# EasyEDA Pro project ProPrj_VFD_DynoClock_ESP32_2025-04-16.epro, board main board_1
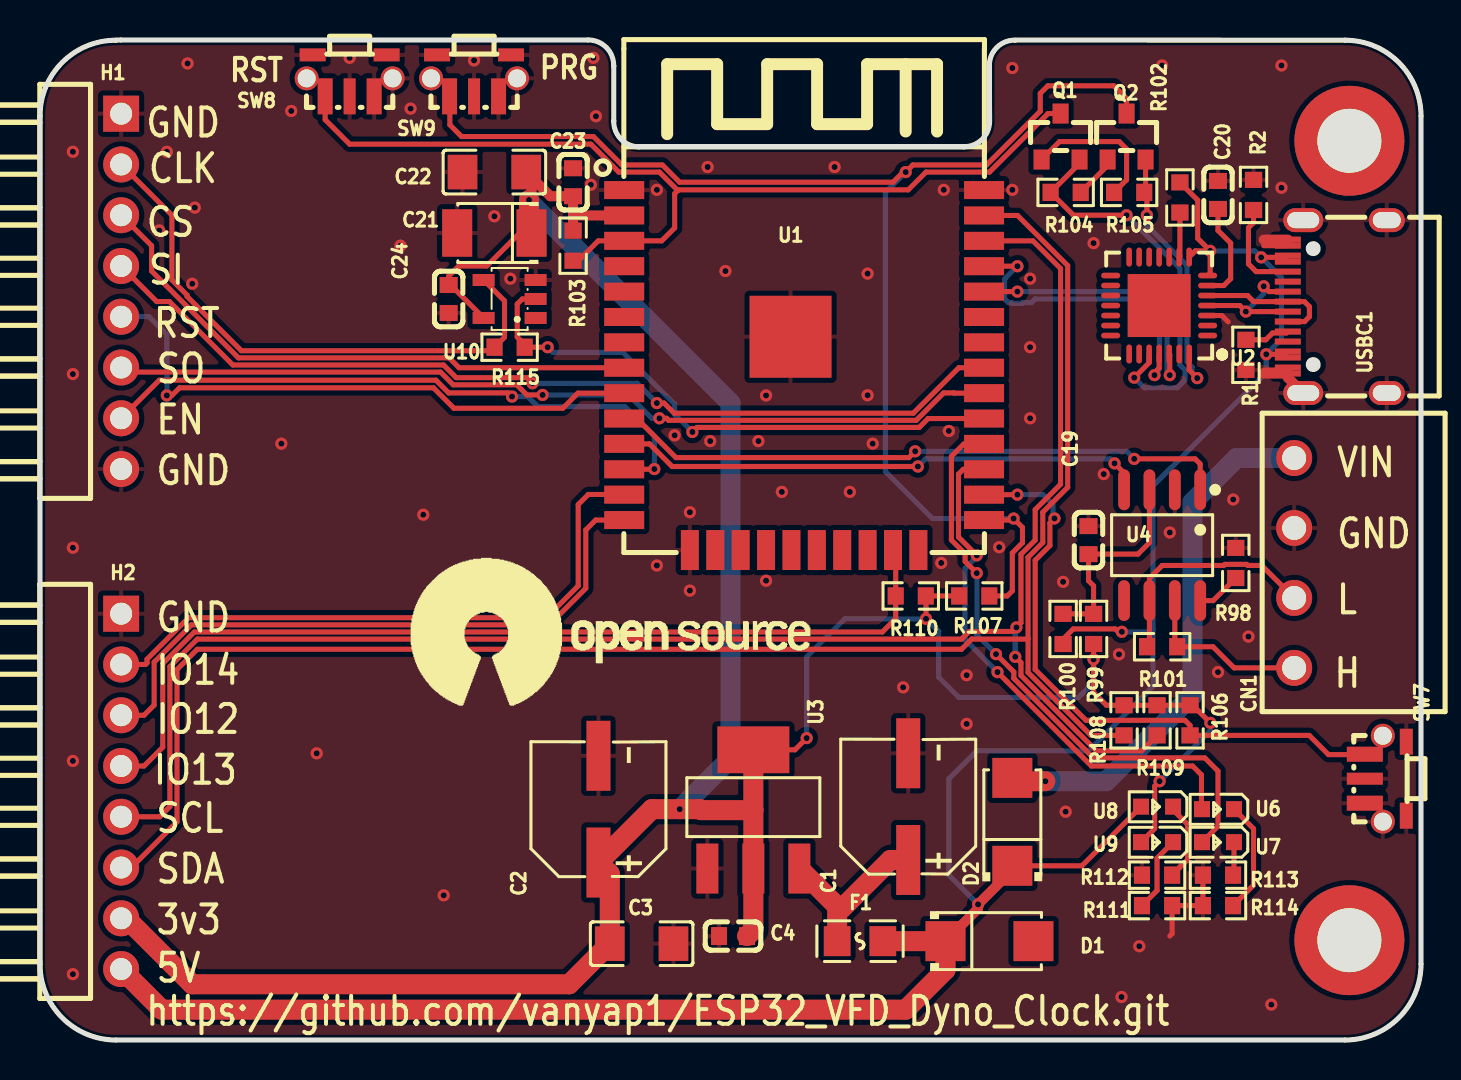
[diagram p2: board, top side]
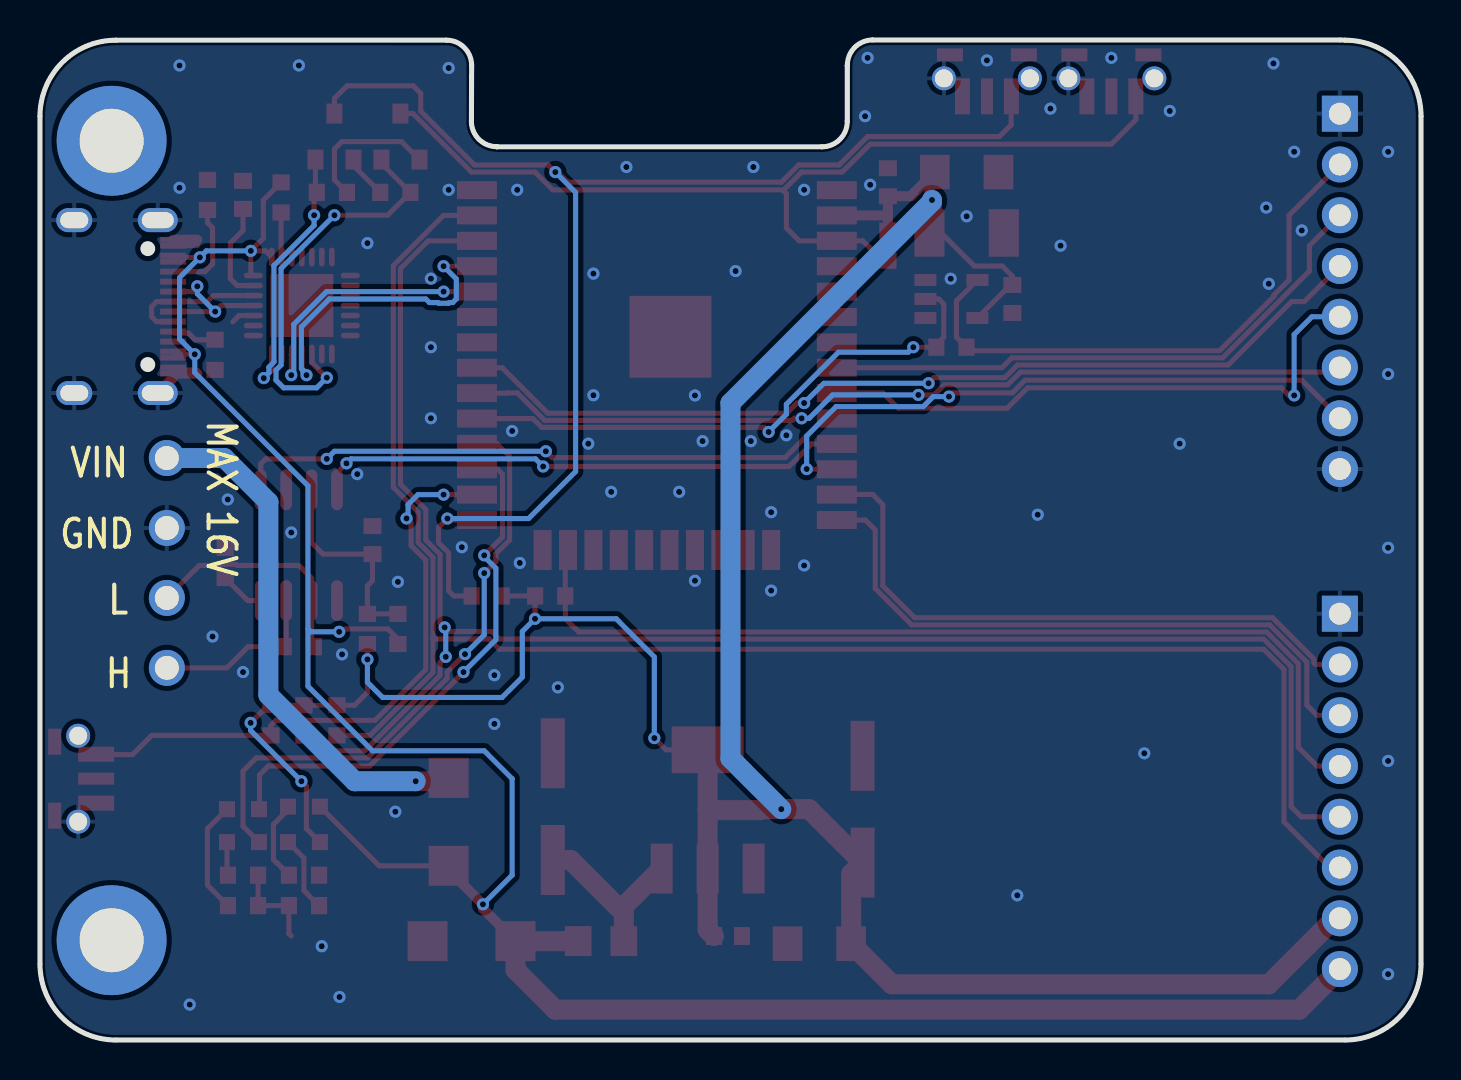
[diagram p3: board, bottom side, seen from below]

Outline 69.08 x 50.04 mm; copper layers: Top Layer, Bottom Layer. Coordinates in mm from the lower left corner of the outline.
Outline path: 0,46.23 arc(1.11,48.92) 3.8,50.03 4.05,50.04 27.43,50.04 arc(28.33,49.66) 28.69,48.76 28.7,48.75 28.7,45.98 arc(29.06,45.07) 29.96,44.69 46.22,44.69 46.22,44.7 arc(47.12,45.07) 47.5,45.97 47.49,48.77 arc(47.86,49.67) 48.77,50.03 65.28,50.03 arc(67.97,48.92) 69.08,46.23 69.08,3.8 arc(67.97,1.11) 65.28,0 3.8,0 arc(1.11,1.11) 0,3.8 0,46.23
Stack: Top Layer 0.035mm / Dielectric1 1.51mm FR4 er 4.5 / Bottom Layer 0.035mm

## Design rules (mm)
template: JLCPCB Capability(Two Layers Board)
spacing copperThickness1oz (default): track to track 0.102, other pairs 0.152 to 0.3
spacing copperThickness2oz: track to track 0.203, other pairs 0.152 to 0.3
track width copperThickness1oz (default): min 0.127, default 0.254, max 2.54
track width copperThickness2oz: min 0.203, default 0.254, max 2.54
differential pair differentialPair (default): width min 0.127, default 0.254, max 2.54; gap min 0.152, default 0.152
via viaSize (default): diameter min 0.5, default 0.61, max 10; hole min 0.3, default 0.305, max 6.3

## Placement (name value [footprint] x y rotation side)
C1  330uF  [CAP-SMD_BD6.3-L6.6-W6.6-LS7.4-FD]  43.43 11.68 90 top
C2  330uF  [CAP-SMD_BD6.3-L6.6-W6.6-LS7.4-FD]  27.94 11.55 90 top
C3  10uF  [C1206]  30.09 4.82 180 top
C4  100nF  [C0603]  34.67 5.2 0 top
C19  100nF  [C0603]  52.45 25.01 270 top
C20  100nF  [C0603]  58.92 42.29 270 top
C21  100uF  [CASE-B_3528]  22.73 40.38 180 top
C22  10uF  [C1206]  22.73 43.43 0 top
C23  100nF  [C0603]  26.66 42.92 270 top
C24  100nF  [C0603]  20.44 37.08 90 top
CN1  WJ15EDGRC-3.5-4P  [CONN-TH_4P-P3.50_WJ15EDGRC-3.5]  62.73 23.87 90 top
D1  SS34  [SMA_L4.3-W2.6-LS5.2-RD]  47.49 4.95 0 top
D2  SS34  [SMA_L4.3-W2.6-LS5.2-RD]  48.64 10.92 90 top
F1  0ZCK0020FF2G  [F0805]  41.02 4.95 180 top
H1  PZ254R-11-08P  [HDR-TH_8P-P2.54-H-M-W10.4]  4.06 37.46 270 top
H2  PZ254R-11-08P  [HDR-TH_8P-P2.54-H-M-W10.4]  4.06 12.44 270 top
NOREF  -  [Pad_e6]  65.5 5 0 top
NOREF#2  -  [Pad_e9]  65.5 45 0 top
Q1  MMBT2222A  [SOT-23_L2.9-W1.3-P1.90-LS2.4-BR]  51.05 45.21 270 top
Q2  MMBT2222A  [SOT-23_L2.9-W1.3-P1.90-LS2.4-BR]  54.35 45.21 270 top
R1  5.1kΩ  [R0603]  60.32 34.29 90 top
R2  5.1kΩ  [R0603]  60.7 42.29 90 top
R98  10kΩ  [R0603]  59.81 23.87 90 top
R99  0Ω  [R0603]  52.7 20.57 90 top
R100  0Ω  [R0603]  51.18 20.57 90 top
R101  120Ω  [R0603]  56.13 19.68 0 top
R102  10kΩ  [R0603]  57.02 42.16 270 top
R103  10kΩ  [R0603]  26.66 39.75 90 top
R104  10kΩ  [R0603]  51.3 42.41 0 top
R105  10kΩ  [R0603]  54.48 42.41 180 top
R106  10kΩ  [R0603]  57.53 16 90 top
R107  10kΩ  [R0603]  46.73 22.22 180 top
R108  10kΩ  [R0603]  54.22 16 90 top
R109  10kΩ  [R0603]  55.88 16 90 top
R110  10kΩ  [R0603]  43.56 22.22 0 top
R111  680Ω  [R0603]  55.88 6.73 180 top
R112  680Ω  [R0603]  55.88 8.25 0 top
R113  680Ω  [R0603]  58.92 8.25 0 top
R114  680Ω  [R0603]  58.92 6.73 0 top
R115  0Ω  [R0603]  23.49 34.67 180 top
SW7  HX TS35CA-XL 250gf  [KEY-SMD_HX-TS35CA-250GF]  67.31 13.08 270 top
SW8  HX TS35CA-XL 250gf  [KEY-SMD_HX-TS35CA-250GF]  15.49 48.26 0 top
SW9  HX TS35CA-XL 250gf  [KEY-SMD_HX-TS35CA-250GF]  21.71 48.26 0 top
U1  ESP32-WROOM-32-N4  [WIFIM-SMD_ESP32-WROOM-32-N4]  38.22 33.52 0 top
U2  CP2102-GM  [QFN-28_L5.0-W5.0-P0.50-TL-EP3.2]  55.98 36.75 180 top
U3  A1117-3.3  [SOT-223-3_L6.5-W3.4-P2.30-LS7.0-BR-1]  35.68 11.55 270 top
U4  SN65HVD230D  [SOIC-8_L4.9-W3.9-P1.27-LS6.0-BL]  56.13 24.76 180 top
U6  NCD0603Y5  [LED0603-RD]  58.92 11.55 180 top
U7  NCD0603Y5  [LED0603-RD]  58.92 9.9 180 top
U8  NCD0603Y5  [LED0603-RD]  55.88 11.68 180 top
U9  NCD0603Y5  [LED0603-RD]  55.88 9.9 180 top
U10  SN74LVC1G14DBVR  [SOT-23-5_L3.0-W1.7-P0.95-LS2.8-BR]  23.49 37.08 0 top
USBC1  TYPE-C-31-M-12  [USB-C_SMD-TYPE-C-31-M-12]  64.89 36.7 90 top

## Footprints (pads in the part's own frame, mm; a bottom-side part is the same pattern mirrored in y, then rotated)
C0603
  rect 0.8x0.9 smd: 1(-0.7,0) 2(0.7,0)
C1206
  rect 1.485x1.728 smd: 1(-1.593,0) 2(1.593,0)
CAP-SMD_BD6.3-L6.6-W6.6-LS7.4-FD
  rect 3.5x1.2 smd: 1(-2.67,0) 2(2.67,0)
CASE-B_3528
  rect 1.506x2.376 smd: 1(-1.861,0) 2(1.861,0)
CONN-TH_4P-P3.50_WJ15EDGRC-3.5
  round 1.8 hole 1.2: 1(-5.25,0) 2(-1.75,0) 3(1.75,0) 4(5.25,0)
F0805
  rect 1.335x1.5 smd: 1(-1.143,0) 2(1.143,0)
HDR-TH_8P-P2.54-H-M-W10.4
  rect 1.8x1.8 hole 1.1: 1(-8.89,0)
  round 1.8 hole 1.1: 2(-6.35,0) 3(-3.81,0) 4(-1.27,0) 5(1.27,0) 6(3.81,0) 7(6.35,0) 8(8.89,0)
KEY-SMD_HX-TS35CA-250GF
  round 1.2 hole 0.9: 1(-2.15,-0.138) 3(2.15,-0.138)
  rect 0.75x1.8 smd: 1(-1.225,-1.038) 3(1.225,-1.038)
  rect 0.6x1.8 smd: 2(0,-1.038)
  rect 1.3x0.65 smd: 4(-1.85,1.038) 4(1.85,1.038)
LED0603-RD
  rect 0.8x0.8 smd: 1(-0.799,0) 2(0.799,0)
Pad_e6
  round 5.5 hole 3.2: 1(0,0)
Pad_e9
  round 5.5 hole 3.2: 1(0,0)
QFN-28_L5.0-W5.0-P0.50-TL-EP3.2
  oval 0.95x0.28 smd: 1(-2.425,1.502) 2(-2.425,1.001) 3(-2.425,0.5) 4(-2.425,0) 5(-2.425,-0.5) 6(-2.425,-1) 7(-2.425,-1.501) 15(2.425,-1.501) 16(2.425,-1) 17(2.425,-0.5) 18(2.425,0) 19(2.425,0.5) 20(2.425,1.001) 21(2.425,1.502)
  oval 0.28x0.95 smd: 8(-1.502,-2.425) 9(-1.001,-2.425) 10(-0.5,-2.425) 11(0,-2.425) 12(0.5,-2.425) 13(1,-2.425) 14(1.501,-2.425) 22(1.501,2.425) 23(1,2.425) 24(0.5,2.425) 25(0,2.425) 26(-0.5,2.425) 27(-1.001,2.425) 28(-1.502,2.425)
  rect 3.15x3.15 smd: 29(0,0)
R0603
  rect 0.806x0.864 smd: 1(-0.753,0) 2(0.753,0)
SMA_L4.3-W2.6-LS5.2-RD
  rect 2x2 smd: 1(-2.2,0) 2(2.2,0)
SOIC-8_L4.9-W3.9-P1.27-LS6.0-BL
  oval 0.588x2.045 smd: 1(-1.905,-2.772) 2(-0.635,-2.772) 3(0.635,-2.772) 4(1.905,-2.772) 5(1.905,2.772) 6(0.635,2.772) 7(-0.635,2.772) 8(-1.905,2.772)
SOT-23-5_L3.0-W1.7-P0.95-LS2.8-BR
  rect 1.1x0.6 smd: 1(1.3,-0.95) 2(1.3,0) 3(1.3,0.95) 4(-1.3,0.95) 5(-1.3,-0.95)
SOT-23_L2.9-W1.3-P1.90-LS2.4-BR
  rect 1x0.8 smd: 1(1.15,-0.95) 2(1.15,0.95) 3(-1.15,0)
SOT-223-3_L6.5-W3.4-P2.30-LS7.0-BR-1
  rect 2.5x1.1 smd: 1(2.97,-2.3) 2(2.97,0) 3(2.97,2.3)
  rect 2.34x3.6 smd: 2(-2.97,0)
USB-C_SMD-TYPE-C-31-M-12
  oval 1.2x2 hole 0.8x1.6: 0(-4.325,1.706) 1(4.325,1.706)
  oval 1.2x1.8 hole 0.8x1.4: 2(4.325,-2.474) 3(-4.325,-2.474)
  rect 0.3x1.3 smd: A1(-3.35,2.474) A4(-2.55,2.474) A5(-1.25,2.474) A6(-0.25,2.474) A7(0.25,2.474) A8(1.25,2.474) A9(2.55,2.474) A12(3.35,2.474) B1(3.05,2.474) B4(2.25,2.474) B5(1.75,2.474) B6(0.75,2.474) B7(-0.75,2.474) B8(-1.75,2.474) B9(-2.25,2.474) B12(-3.05,2.474)
WIFIM-SMD_ESP32-WROOM-32-N4
  rect 2x0.9 smd: 1(-9,9.005) 2(-9,7.735) 3(-9,6.465) 4(-9,5.195) 5(-9,3.925) 6(-9,2.655) 7(-9,1.385) 8(-9,0.115) 9(-9,-1.155) 10(-9,-2.425) 11(-9,-3.695) 12(-9,-4.965) 13(-9,-6.235) 14(-9,-7.505) 25(9,-7.505) 26(9,-6.235) 27(9,-4.965) 28(9,-3.695) 29(9,-2.425) 30(9,-1.155) 31(9,0.115) 32(9,1.385) 33(9,2.655) 34(9,3.925) 35(9,5.195) 36(9,6.465) 37(9,7.735) 38(9,9.005)
  rect 0.9x2 smd: 15(-5.715,-9.005) 16(-4.445,-9.005) 17(-3.175,-9.005) 18(-1.905,-9.005) 19(-0.635,-9.005) 20(0.635,-9.005) 21(1.905,-9.005) 22(3.175,-9.005) 23(4.445,-9.005) 24(5.715,-9.005)
  rect 4.1x4.1 smd: 39(-0.68,1.665)

## Nets
As in the schematic.

Pads without a net: NOREF 1; NOREF#2 1; U1 4 5 6 7 16 17 18 19 20 21 22 24 32 33; U2 1 2 10 11 12 13 14 15 16 17 18 19 20 21 22 23 27 29; U4 5; U10 1; USBC1 A8 B8

## Via types
v1: diameter 0.61, hole 0.305, Top Layer to Bottom Layer, 114 vias

## Routing (per net, layer and track width the routed paths; a pad name or vN(x,y) marks a point on that pad's centre or on a via; arc(x,y) is an arc through that point)
GND: length 12
  Top Layer w0.254: 61.21,39.75 62.42,39.75 USBC1.B1 ; R113.1 R114.1 R111.1 56.63,5.32 56.51,5.2 ; USBC1.B12 62.29,33.52 61.21,33.52 ; 62.93,32.63 USBC1.0 ; U2.3 59.12,36.25 59.43,35.94
  Top Layer w0.5: USBC1.A12 61.21,40.05 ; 62.93,32.63 62.42,33.14 62.42,33.35 61.21,33.35
  vias: v1(1.65,44.45) v1(1.65,33.32) v1(1.65,24.63) v1(1.65,13.97) v1(1.65,3.3) v1(5.96,40.51) v1(6.34,44.45) v1(7.38,48.87) v1(7.62,37.84) v1(7.74,41.65) v1(12.07,29.84) v1(12.57,46.49) v1(13.84,14.35) v1(15.49,49.14) v1(18.03,39.75) v1(18.54,46.6) v1(19.17,26.28) v1(20.19,7.24) v1(21.71,49.02) v1(22.73,41.22) v1(23.53,38.09) v1(27.55,42.79) v1(27.68,49.14) v1(27.81,46.22) v1(30.86,42.54) v1(30.86,23.74) v1(31.75,30.26) v1(32.51,26.41) v1(32.51,22.49) v1(33.4,43.68) v1(33.52,29.97) v1(34.28,38.48) v1(35.94,29.97) v1(36.32,32.25) v1(36.32,22.98) v1(37.11,27.43) v1(39.75,43.68) v1(40.51,27.43) v1(41.4,38.35) v1(41.4,32.26) v1(41.65,29.84) v1(43.18,17.65) v1(45.08,23.87) v1(45.21,42.54) v1(45.46,30.48) v1(46.35,18.26) v1(46.35,15.82) v1(47.98,24.66) v1(48.64,48.64) v1(48.64,42.54) v1(49.53,38.09) v1(49.53,34.67) v1(49.53,31.11) v1(51.18,22.92) v1(51.3,11.43) v1(52.7,39.87) v1(53.21,28.32) v1(53.97,19.3) v1(54.1,2.15) v1(54.99,4.69) v1(56.13,48.76) v1(56.51,25.4) v1(58.92,18.41) v1(59.69,27.05) v1(60.45,20.19) v1(61.59,1.77) v1(62.1,48.76) v1(62.1,42.64)
VCC3V3: length 148.5
  Top Layer w0.254: C21.1 24,40.38 22.35,38.73 20.95,38.73 20.44,38.22 C24.2 20.54,37.78 U10.5 ; 44.32,22.22 v1(44.32,21.08) ; 44.32,22.22 R107.2 ; 44.32,22.22 R110.2 ; U3.2 37.76,14.52 v1(38.35,15.11) ; v1(56,12.95) 55.75,12.7 55.75,10.58 U9.2 ; v1(58.54,15.87) 57.66,16.75 R106.2 R109.2 R108.2 53.34,16.75 52.7,17.39 v1(52.7,19.05) R99.1
  Top Layer w0.5: 26.66,41.3 C23.2 25.53,42.22 24.59,43.16 ; 26.66,41.3 26.71,41.26 U1.2 ; 26.66,41.3 R103.2 ; 24.59,43.16 C22.2 ; 24.59,43.16 24.59,42.03
  Top Layer w1: 35.68,11.5 33.06,11.5 33.02,11.55 v1(32,11.55) 30.61,11.55 C2.1 28.5,8.32 C3.2 26.47,2.79 7.62,2.79 4.31,6.09 H2.7 ; 35.68,11.5 U3.2 ; 35.68,11.5 U3.2 35.68,5.52 35.37,5.2 ; C21.1 24.46,40.51 v1(24.46,42.03)
  Bottom Layer w0.254: v1(52.7,19.05) 52.7,17.9 51.94,17.14 45.97,17.14 44.95,18.16 44.95,20.44 v1(44.32,21.08) 40.25,21.08 38.35,19.17 v1(38.35,15.11) ; v1(56,12.95) 58.54,15.49 v1(58.54,15.87)
  Bottom Layer w1: v1(24.46,42.03) 24.46,41.95 34.54,31.87 34.54,14.09 v1(32,11.55)
VCC5V: length 120.7
  Top Layer w0.254: D2.1 52.11,8.72 U8.2 ; v1(61.08,39.16) 62.2,39.16 USBC1.B4 ; R100.1 51.18,20.06 51.68,20.57 53.79,20.57 53.93,20.43 v1(54.11,20.43) ; R102.1 57.91,42.02 57.91,40.11 v1(58.53,39.49) ; v1(58.53,39.49) 58.53,38.38 U2.7 ; v1(58.53,39.49) 57.79,39.49 U2.8 ; USBC1.A4 62.25,34.31 v1(61.34,34.31)
  Top Layer w0.5: D2.1 48.64,8.5 v1(46.92,6.79) 46.92,6.58 D1.1
  Top Layer w1: H2.8 6.09,1.52 43.3,1.52 45.29,3.51 D1.1 F1.1
  Bottom Layer w0.254: v1(54.11,20.43) 55.53,20.43 55.67,20.57 ; 55.67,20.57 55.67,17.7 52.45,14.47 46.86,14.47 45.46,13.08 45.46,8.25 v1(46.92,6.79) ; 55.67,20.57 55.67,27.73 61.34,33.4 v1(61.34,34.31) 62.1,35.08 62.1,38.15 v1(61.08,39.16) 60.76,39.49 v1(58.53,39.49)
VIN1: length 26.2
  Top Layer w1: v1(50.29,12.95) 48.93,12.95 48.89,12.99
  Bottom Layer w1: v1(50.29,12.95) 53.34,12.95 57.65,17.27 57.65,26.92 59.86,29.12 CN1.4
CAN_RX: length 26.8
  Top Layer w0.254: U4.4 54.22,28.38 v1(53.75,28.86) ; v1(43.91,28.7) 31.62,28.7 30.49,29.83 29.22,29.83
  Bottom Layer w0.254: v1(43.91,28.7) 44.29,29.08 53.52,29.08 v1(53.75,28.86)
CAN_TX: length 31.3
  Top Layer w0.254: U4.1 58.03,28.82 57.78,29.08 v1(54.73,29.08) ; v1(43.78,29.46) 43.46,29.14 31.81,29.14 29.85,31.1 U1.10
  Bottom Layer w0.254: v1(43.78,29.46) 54.35,29.46 v1(54.73,29.08)
CC1: length 2.3
  Top Layer w0.254: R1.2 61.31,35.04 61.65,35.38 62.35,35.38 USBC1.A5
CC2: length 4.9
  Top Layer w0.254: R2.1 60.7,40.9 60.45,40.64 60.45,38.83 60.83,38.45 USBC1.B5
CS: length 29.1
  Top Layer w0.254: H1.3 5.58,39.75 5.58,38.48 9.93,34.13 20.47,34.13 20.96,33.64 U1.8
DN: length 7
  Top Layer w0.254: U2.5 60.4,37.25 60.71,36.95 USBC1.A7 63.25,36.95 63.5,36.7 63.5,36.19 63.25,35.95 USBC1.B7
DP: length 7.1
  Top Layer w0.254: U2.4 60.01,36.75 v1(60.32,36.45) USBC1.A6 ; USBC1.B6 61.47,37.45 v1(61.21,37.71)
  Bottom Layer w0.254: v1(60.32,36.45) 61.21,37.34 v1(61.21,37.71)
DTR: length 13.4
  Top Layer w0.254: U2.28 57.48,33.52 v1(57.88,33.12) ; Q2.2 55.3,42.48 R105.1 55.37,42.28 v1(55.37,41.27)
  Bottom Layer w0.254: v1(57.88,33.12) 57.63,33.38 57.63,33.67 57.37,33.92 57.37,38.76 55.37,40.76 v1(55.37,41.27)
EXT3: length 32.2
  Top Layer w0.254: H2.3 5.2,16.25 5.71,16.76 5.71,18.91 7.57,20.77 25.47,20.77 27.3,22.6 27.3,25.52 27.8,26.02 U1.14
EXT4: length 31.2
  Top Layer w0.254: H2.2 5.28,18.79 5.35,18.87 5.35,19.06 7.43,21.13 25.32,21.13 26.92,22.73 26.92,26.79 27.43,27.3 29.21,27.3 U1.13
HTTP: length 26.6
  Top Layer w0.254: U1.27 46.19,28.56 45.94,28.32 45.94,25.17 v1(46.86,24.25) ; U6.2 58.1,11.58 58.1,13.27 57.65,13.71 52.59,13.71 48.36,17.95 v1(47.89,18.41)
  Bottom Layer w0.254: v1(47.89,18.41) 46.27,20.03 46.27,23.61 46.86,24.19 v1(46.86,24.25)
INT: length 47.7
  Top Layer w0.254: H2.4 5.2,13.71 6.14,14.65 6.14,18.84 7.72,20.42 42.13,20.42 42.8,21.09 R110.1 42.8,24.38 U1.23
IO0: length 69.6
  Top Layer w0.254: R107.1 48.38,22.22 48.64,22.47 48.64,24.37 49.14,24.88 49.14,25.65 v1(48.7,26.09) 48.62,26.02 U1.25 ; Q2.3 54.35,47.11 53.72,47.75 50.41,47.75 50.03,47.37 50.03,46.47 47.35,43.79 43.66,43.79 v1(43.3,43.43) 43.18,43.43 42.67,42.92 31.99,42.92 31.13,43.79 29.1,43.79 27.68,45.21 21.09,45.21 20.5,45.79 20.5,47.2 SW9.1
  Bottom Layer w0.254: v1(43.3,43.43) 42.29,42.41 42.29,28.44 44.64,26.09 v1(48.7,26.09)
MISO: length 44.8
  Top Layer w0.254: H1.6 4.29,33.42 20.04,33.42 20.67,32.79 23.85,32.79 24.35,32.28 v1(25.14,32.28) ; U1.30 45.73,32.37 45.72,32.38 45.2,32.38 43.83,31.01 31.44,31.01 31.34,31.11 v1(30.98,31.11)
  Bottom Layer w0.254: v1(30.98,31.11) 30.6,31.11 29.43,32.28 v1(25.14,32.28)
MOSI: length 47.2
  Top Layer w0.254: v1(24.63,32.86) 24.35,33.14 20.82,33.14 20.18,33.78 9.65,33.78 6.47,36.95 5.84,36.95 H1.4 ; v1(30.86,31.87) 31.22,31.87 31.72,31.36 43.68,31.36 45.96,33.64 U1.31
  Bottom Layer w0.254: v1(30.86,31.87) 29.87,32.86 v1(24.63,32.86)
RESET: length 48.7
  Top Layer w0.254: 31.9,42.51 31.75,42.35 31.75,40.64 31.1,39.99 27.92,39.99 26.93,38.99 R103.1 ; 31.9,42.51 31.94,42.54 43.43,42.54 44.32,43.43 47.49,43.43 50.42,46.36 Q1.3 ; 31.9,42.51 30.98,43.43 28.95,43.43 27.55,44.83 15.49,44.83 14.26,46.05 SW8.1
RST: length 29.5
  Top Layer w0.254: v1(6.34,32.25) 6.6,32.25 6.98,32.63 19.68,32.63 20.7,31.61 26.15,31.61 26.91,32.37 U1.9
  Bottom Layer w0.254: v1(6.34,32.25) 6.34,35.3 5.46,36.19 H1.5
RTS: length 20.4
  Top Layer w0.254: v1(54.35,41.27) 51.69,41.27 R104.1 52,43.86 Q1.2 ; v1(54.73,33.14) 55.48,33.89 U2.24
  Bottom Layer w0.254: v1(54.73,33.14) 55.24,32.63 56.89,32.63 57.27,33.02 57.27,33.52 57.02,33.78 57.02,38.6 v1(54.35,41.27)
RX0: length 13.5
  Top Layer w0.254: v1(56.51,33.27) 56.51,34.3 U2.26 ; U1.34 v1(48.89,37.45)
  Bottom Layer w0.254: v1(48.89,37.45) 54.74,37.45 56.38,35.81 56.38,33.4 v1(56.51,33.27)
SCK: length 28.6
  Top Layer w0.254: U10.2 24.12,37.08 23.87,36.83 23.87,35.17 24.24,34.8 R115.1 v1(25.4,34.67) ; v1(32.63,30.42) 32.86,30.65 43.98,30.65 44.42,31.1 U1.29
  Bottom Layer w0.254: v1(32.63,30.42) 31.75,31.31 31.75,31.81 29.14,34.41 25.65,34.41 v1(25.4,34.67)
SCL: length 87.3
  Top Layer w0.254: v1(48.78,19.17) 49.07,18.89 49.07,18.24 52.84,14.47 55.11,14.47 55.88,15.23 R109.1 ; 47.22,39.99 49.66,39.99 51.05,38.6 51.05,27.81 49.78,26.54 49.78,25.01 49.07,24.3 49.07,20.87 v1(48.84,20.65) 48.64,20.44 46.48,20.44 46.1,20.06 7.87,20.06 6.5,18.69 6.5,11.68 5.99,11.17 H2.5
  Bottom Layer w0.254: v1(48.78,19.17) 48.78,20.59 v1(48.84,20.65)
SDA: length 87.1
  Top Layer w0.254: 49.42,20.09 49.42,18.39 52.57,15.24 R108.1 ; 49.42,20.09 49.42,24.15 50.16,24.89 50.16,26.41 51.41,27.66 51.41,38.75 48.9,41.26 U1.37 ; 49.42,20.09 49.4,20.06 46.6,20.06 46.09,19.55 7.87,19.55 6.85,18.54 6.85,10.92 4.57,8.63 H2.6
TX0: length 15.7
  Top Layer w0.254: v1(55.75,33.27) 55.75,33.4 55.98,33.63 U2.25 ; U1.35 v1(48.89,38.72)
  Bottom Layer w0.254: v1(55.75,33.27) 55.93,33.45 55.93,33.51 56,33.59 56,35.68 54.61,37.08 49.78,37.08 49.6,36.9 49.17,36.9 49.13,36.86 48.65,36.86 48.61,36.9 48.43,36.9 48.25,37.08 48.25,38.08 v1(48.89,38.72)
USER_BTN: length 30.9
  Top Layer w0.254: U1.26 v1(48.89,27.29) ; SW7.1 66.25,14.28 64.45,14.28 63.49,15.24 R106.1 57.53,15.74 57.27,16 52.32,16 49.78,18.54 49.78,24.01 50.52,24.74 50.52,25.87 v1(50.74,26.1)
  Bottom Layer w0.254: v1(48.89,27.29) 50.17,27.29 50.67,26.79 50.67,26.18 v1(50.74,26.1)
VFD_EN: length 31.8
  Top Layer w0.254: v1(30.73,28.57) 30.72,28.56 U1.12 ; v1(23.61,32.2) 23.43,32.38 20.44,32.38 19.81,33.02 5.96,33.02 H1.7
  Bottom Layer w0.254: v1(23.61,32.2) 24.4,32.2 24.9,31.69 29.26,31.69 30.73,30.22 v1(30.73,28.57)
WIFI: length 30.3
  Top Layer w0.254: 47.22,29.83 46.21,29.83 45.59,29.2 45.59,25.02 46.27,24.33 46.27,23.95 v1(46.86,23.36) ; U7.2 58.92,10.7 58.92,13.46 58.26,14.12 52.69,14.12 48.71,18.09 48.71,18.42 v1(47.82,19.31)
  Bottom Layer w0.254: v1(46.86,23.36) 46.86,20.27 v1(47.82,19.31)
$1N1609: length 8.7
  Top Layer w1: F1.2 39.87,6.69 U3.3 ; C1.1 42.54,9.01 40.13,6.6
$1N3246: length 2.2
  Top Layer w0.254: R98.1 58.68,21.99 U4.8
$1N3386: length 10.6
  Top Layer w0.254: U4.3 55.49,24.89 54.92,24.31 C19.2 52.45,22.98 52.7,22.73 R99.2 R100.2
$1N3572: length 8.6
  Top Layer w0.254: U4.7 56.76,19.8 R101.2 58.67,19.68 59.73,18.62 CN1.1
$1N3578: length 11.7
  Top Layer w0.254: CN1.2 61.11,23.74 60.42,23.74 60.36,23.8 59.26,23.8 59.21,23.74 56.13,23.74 55.49,23.11 U4.6 55.49,19.8 R101.1
$1N4140: length 2.2
  Top Layer w0.254: U2.9 57.02,39.21 R102.2
$1N4204: length 5
  Top Layer w0.254: U2.6 59.21,37.75 59.56,38.09 59.56,39.87 58.92,40.51 C20.2
$1N4780: length 2.2
  Top Layer w0.254: R104.2 53.4,43.76 Q2.1
$1N4796: length 7.2
  Top Layer w0.254: R105.2 54.35,43.04 54.35,44.58 53.98,44.95 51,44.95 Q1.1
$1N6694: length 28.6
  Top Layer w0.254: U10.4 23.24,36.98 23.24,35.17 R115.2 22.56,34.49 10.07,34.49 7.36,37.2 7.36,37.27 6.6,38.03 6.6,41.27 H1.2
$1N7635: length 3.8
  Top Layer w0.254: U9.1 55.88,9.1 55.88,7.48 R111.2
$1N7639: length 4.1
  Top Layer w0.254: R112.2 57.01,8.63 57.01,8.65 57.21,8.86 57.24,8.86 57.4,9.02 57.4,10.79 56.67,11.51 U8.1
$1N7644: length 1.7
  Top Layer w0.254: R113.2 59.72,8.3 U7.1
$1N7649: length 5.7
  Top Layer w0.254: R114.2 60.7,7.75 60.7,10.57 U6.1

## Copper pours and planes (outline as drawn; the poured copper is in the pictures)
GND on Top Layer: -0.13,50.16 69.21,50.16 69.21,-0.13 -0.13,-0.13
GND on Bottom Layer: 0.12,50.16 69.21,50.16 69.21,-0.13 0.12,-0.13

## Text on the board
Bottom Silkscreen Layer: L | H | VIN | GND | MAX 16V
Top Silkscreen Layer: RST | PRG | GND | https://github.com/vanyap1/ESP32_VFD_Dyno_Clock.git | CS | CLK | SI | IO13 | EN | IO14 | IO12 | SCL | SDA | 3v3 | 5V | SO | H | VIN | L
